# Altium schematic sheet Sheet2.SchDoc
size A; SheetNumber: 2; SheetTotal: 2; SPICEModelCacheROXHESGZ: <root> / <DocumentId>ROXHESGZ</DocumentId> / <CacheFrame Number="0"> / <Model Name="cap" Kind="MDL"> / <Text>*Default semiconductor capacitor / .MODEL CAP C()</Text> / </Model> / <Model Name="1n4149" Kind="MDL"> / <Text>*1N4149 MCE 3-13-97 / *Ref: National Discrete Products Databook, 1996 / *75V 10mA Si Computer Diode pkg:DIODE0.4 1,2 / .MODEL 1N4149 D (IS=14.2P RS=4.2 N=1.7 BV=75 IBV=5U / + CJO=1.74P VJ=0.75 M=0.333 TT=4.32N)</Text> / </Model> / </CacheFrame> / </root>
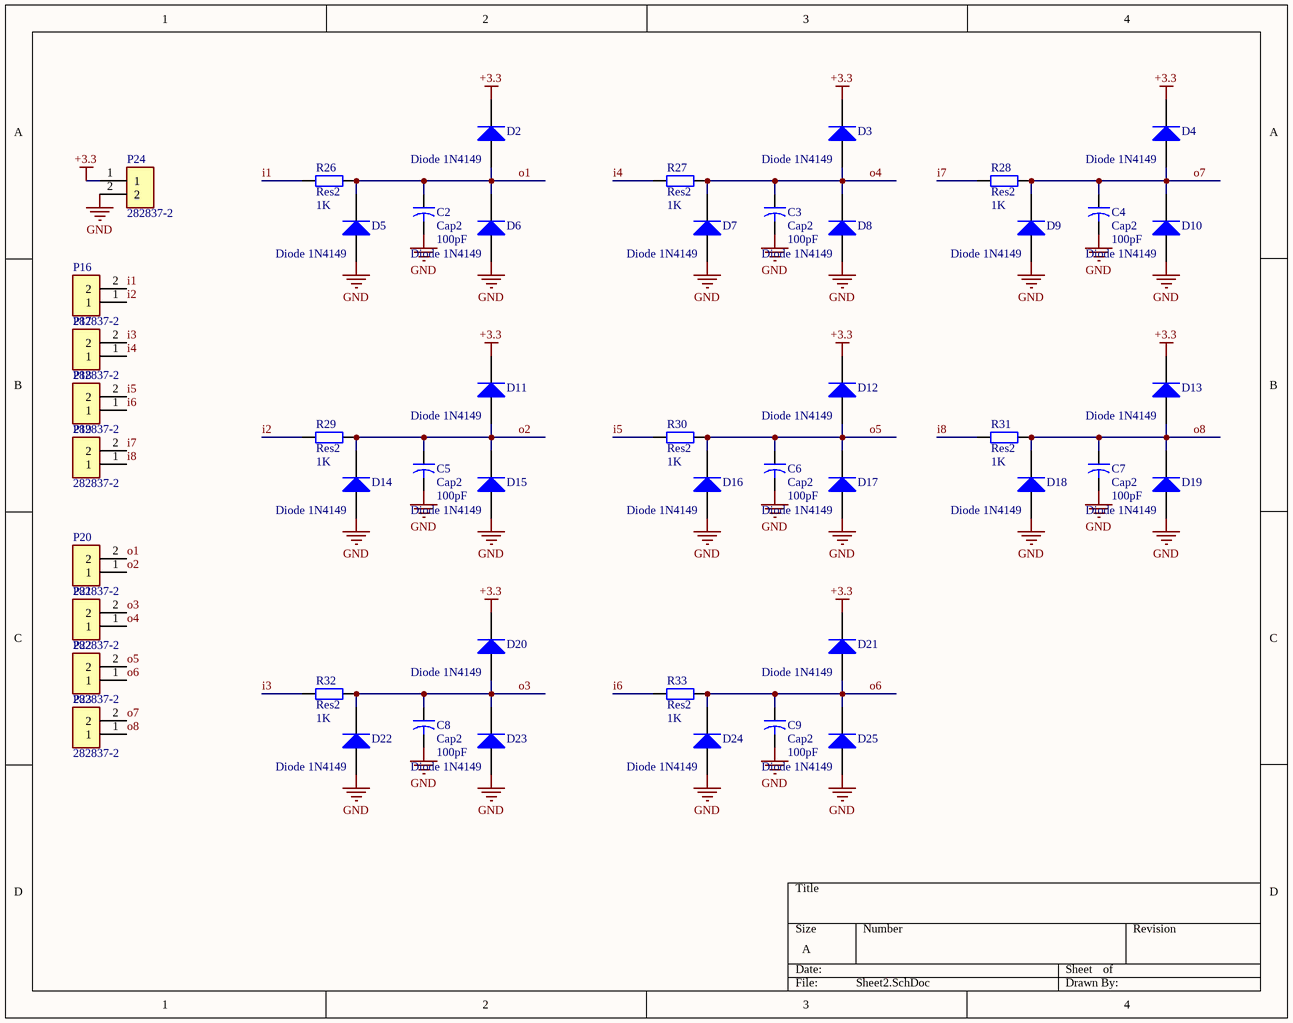
[diagram p0: Sheet2.SchDoc]

## Parts
C2  Cap2  value 100pF  [CAPR5-4X5]
C3  Cap2  value 100pF  [CAPR5-4X5]
C4  Cap2  value 100pF  [CAPR5-4X5]
C5  Cap2  value 100pF  [CAPR5-4X5]
C6  Cap2  value 100pF  [CAPR5-4X5]
C7  Cap2  value 100pF  [CAPR5-4X5]
C8  Cap2  value 100pF  [CAPR5-4X5]
C9  Cap2  value 100pF  [CAPR5-4X5]
D2  Diode 1N4149  [DO-35A]
D3  Diode 1N4149  [DO-35A]
D4  Diode 1N4149  [DO-35A]
D5  Diode 1N4149  [DO-35A]
D6  Diode 1N4149  [DO-35A]
D7  Diode 1N4149  [DO-35A]
D8  Diode 1N4149  [DO-35A]
D9  Diode 1N4149  [DO-35A]
D10  Diode 1N4149  [DO-35A]
D11  Diode 1N4149  [DO-35A]
D12  Diode 1N4149  [DO-35A]
D13  Diode 1N4149  [DO-35A]
D14  Diode 1N4149  [DO-35A]
D15  Diode 1N4149  [DO-35A]
D16  Diode 1N4149  [DO-35A]
D17  Diode 1N4149  [DO-35A]
D18  Diode 1N4149  [DO-35A]
D19  Diode 1N4149  [DO-35A]
D20  Diode 1N4149  [DO-35A]
D21  Diode 1N4149  [DO-35A]
D22  Diode 1N4149  [DO-35A]
D23  Diode 1N4149  [DO-35A]
D24  Diode 1N4149  [DO-35A]
D25  Diode 1N4149  [DO-35A]
P16  282837-2  [TE_282837-2]
P17  282837-2  [TE_282837-2]
P18  282837-2  [TE_282837-2]
P19  282837-2  [TE_282837-2]
P20  282837-2  [TE_282837-2]
P21  282837-2  [TE_282837-2]
P22  282837-2  [TE_282837-2]
P23  282837-2  [TE_282837-2]
P24  282837-2  [TE_282837-2]
R26  Res2  value 1K  [AXIAL-0.4]
R27  Res2  value 1K  [AXIAL-0.4]
R28  Res2  value 1K  [AXIAL-0.4]
R29  Res2  value 1K  [AXIAL-0.4]
R30  Res2  value 1K  [AXIAL-0.4]
R31  Res2  value 1K  [AXIAL-0.4]
R32  Res2  value 1K  [AXIAL-0.4]
R33  Res2  value 1K  [AXIAL-0.4]

## Nets
+3.3: D2.2(K) D3.2(K) D4.2(K) D11.2(K) D12.2(K) D13.2(K) D20.2(K) D21.2(K) P24.1
GND: C2.2 C3.2 C4.2 C5.2 C6.2 C7.2 C8.2 C9.2 D5.1(A) D6.1(A) D7.1(A) D8.1(A) D9.1(A) D10.1(A) D14.1(A) D15.1(A) D16.1(A) D17.1(A) D18.1(A) D19.1(A) D22.1(A) D23.1(A) D24.1(A) D25.1(A) P24.2
i1: P16.2 R26.2
i2: P16.1 R29.2
i3: P17.2 R32.2
i4: P17.1 R27.2
i5: P18.2 R30.2
i6: P18.1 R33.2
i7: P19.2 R28.2
i8: P19.1 R31.2
o1: C2.1 D2.1(A) D5.2(K) D6.2(K) P20.2 R26.1
o2: C5.1 D11.1(A) D14.2(K) D15.2(K) P20.1 R29.1
o3: C8.1 D20.1(A) D22.2(K) D23.2(K) P21.2 R32.1
o4: C3.1 D3.1(A) D7.2(K) D8.2(K) P21.1 R27.1
o5: C6.1 D12.1(A) D16.2(K) D17.2(K) P22.2 R30.1
o6: C9.1 D21.1(A) D24.2(K) D25.2(K) P22.1 R33.1
o7: C4.1 D4.1(A) D9.2(K) D10.2(K) P23.2 R28.1
o8: C7.1 D13.1(A) D18.2(K) D19.2(K) P23.1 R31.1

## Library data of the parts
C2-C9 = Cap2: Capacitor; Published: 23-Sep-2002; PackageReference: CAPR5-4X5; Publisher: Altium Limited; PackageDescription: Capacitor; 2 Leads
D2-D25 = Diode 1N4149: Computer Diode; Published: 8-Jun-2000; LatestRevisionDate: 17-Jul-2002; LatestRevisionNote: Re-released for DXP Platform.; DatasheetVersion: 1989; PackageVersion: 1989; PackageReference: DO-35A; Publisher: Altium Limited; PackageDescription: Diode, Axial; Body 4.6 x 1.9 mm (LxDia. max), Lead Dia. 0.53 mm (max); Code_JEDEC: DO-204-AH; ComponentLink1Description: Manufacturer Link; ComponentLink1URL: http://www.national.com/
P16-P24 = 282837-2: Ð Ð°Ð·ÑŠÐµÐ¼Ð½Ñ‹Ðµ ÐºÐ»ÐµÐ¼Ð¼Ð½Ñ‹Ðµ ÐºÐ¾Ð»Ð¾Ð´ÐºÐ¸ Ð Ð¾Ð·ÐµÑ‚ÐºÐ° 2 Ð¿Ð¾Ð»Ð¾Ð¶ÐµÐ½Ð¸Ñ 5,08 Ð¼Ð¼ ÐŸÑ€Ð¸Ð¿Ð¾Ð¹ Ð¿Ñ€ÑÐ¼Ð¾Ð¹ Ñ‡ÐµÑ€ÐµÐ· Ð¾Ñ‚Ð²ÐµÑ€ÑÑ‚Ð¸Ðµ 13,5 Ð / ÐºÐ¾Ð½Ñ‚Ð°ÐºÑ‚; MF: TE Connectivity; SnapEDA_Link: https://www.snapeda.com/parts/282837-2/TE+Connectivity+AMP+Connectors/view-part/?ref=snap; Price: None; Check_prices: https://www.snapeda.com/parts/282837-2/TE+Connectivity+AMP+Connectors/view-part/?ref=eda; Purchase-URL: https://pricing.snapeda.com/search/part/282837-2/?ref=eda; MP: 282837-2; Value: *; Availability: In Stock; Package: None
R26-R33 = Res2: Resistor; Published: 8-Jun-2000; LatestRevisionDate: 17-Jul-2002; LatestRevisionNote: Re-released for DXP Platform.; PackageReference: AXIAL-0.4; Publisher: Altium Limited; PackageDescription: Axial Device, Thru-Hole; 2 Leads; 0.4 in Pin Spacing